# EAGLE board clock-generator (EAGLE 7.7.0)
REVISION: v2
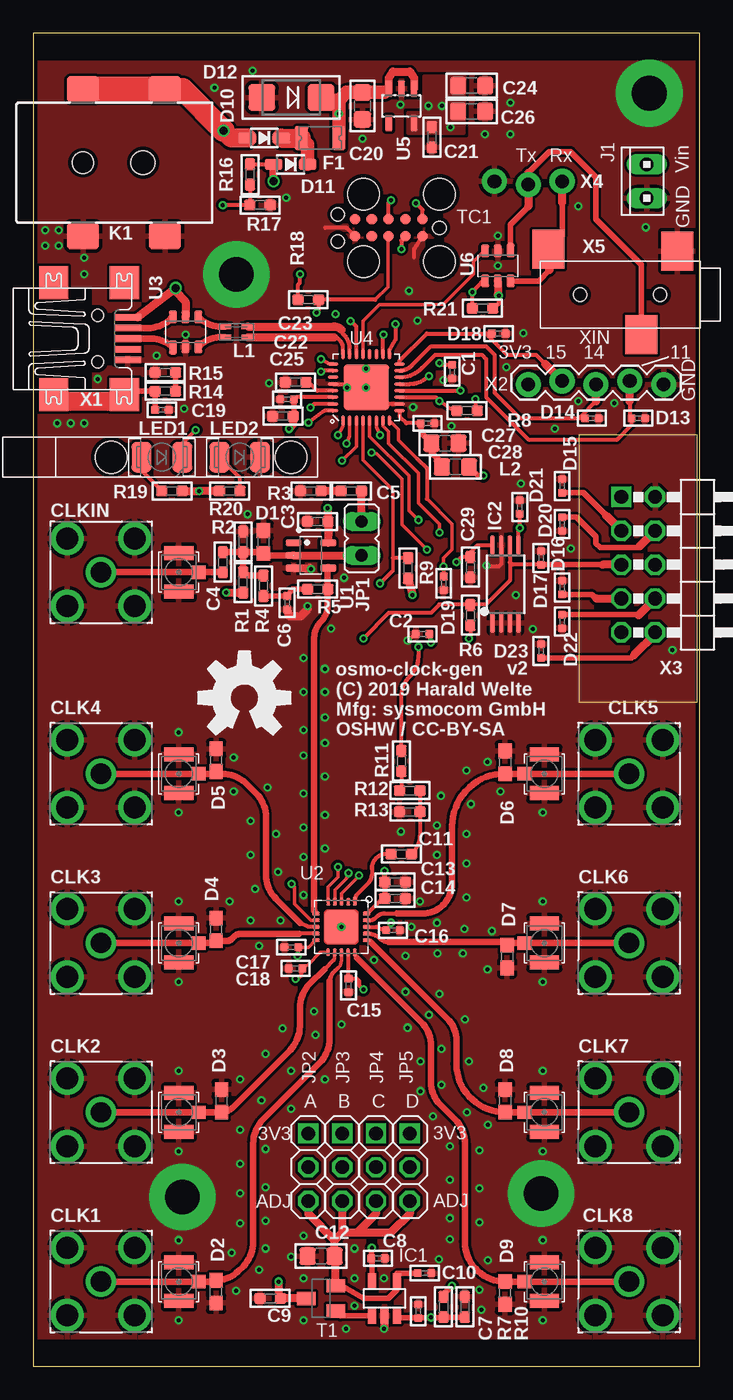
[diagram p2: board, top side]
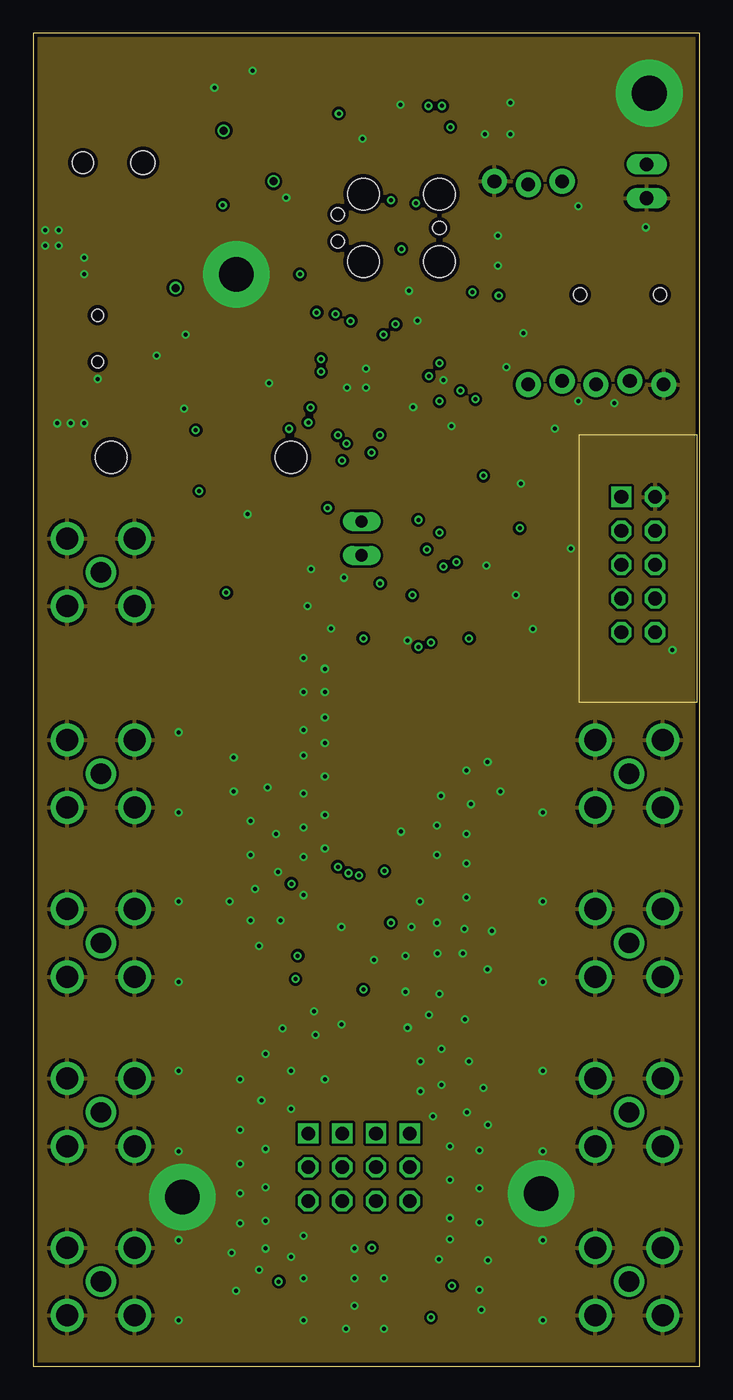
[diagram p3: board, inner layer Route2]
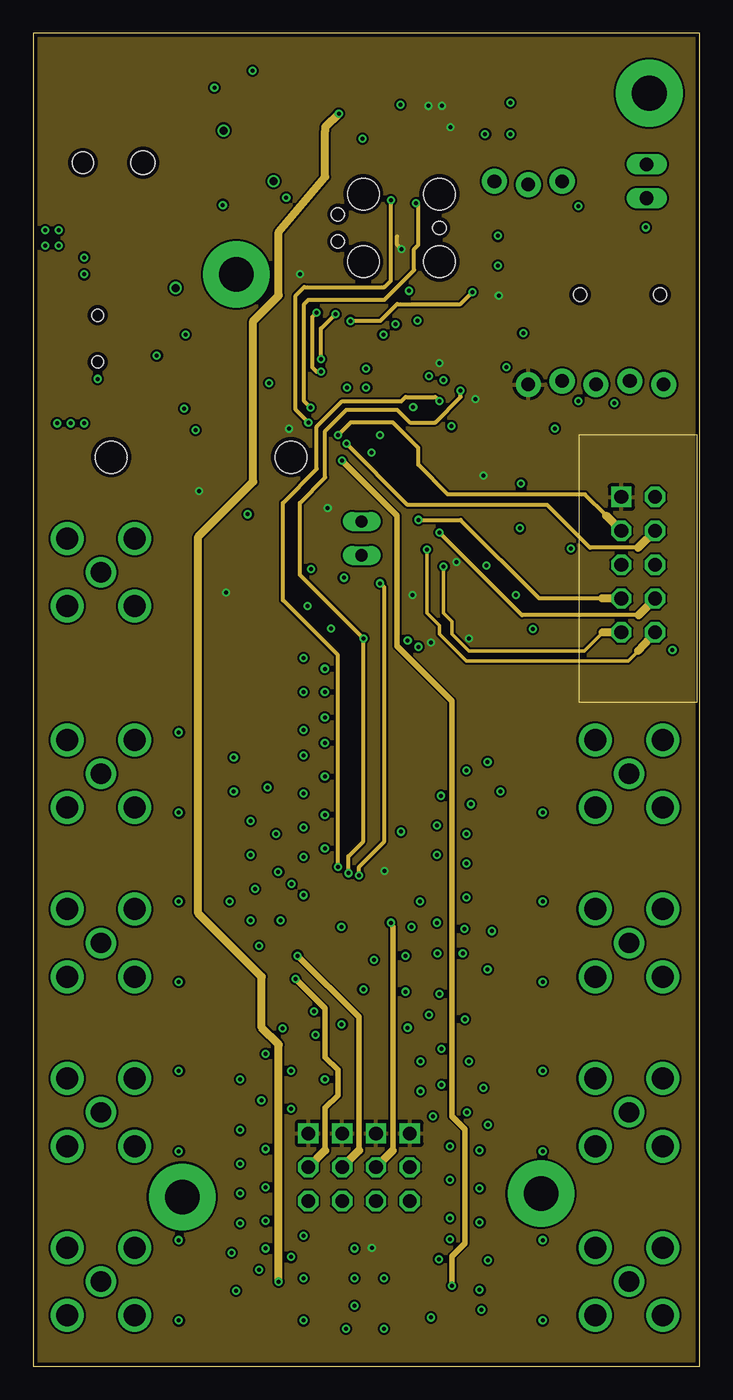
[diagram p4: board, inner layer Route15]
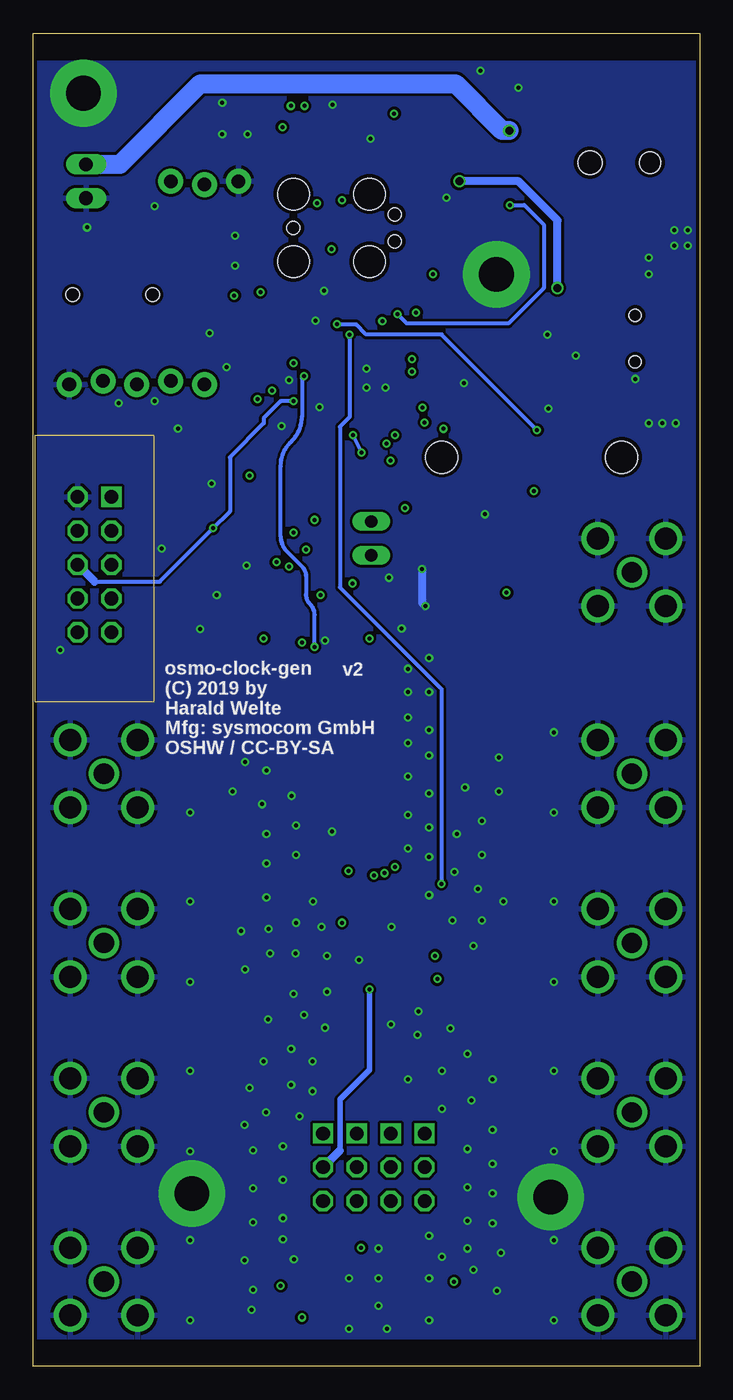
[diagram p5: board, bottom side, seen from below]

Size 50 x 100 mm. Coordinates in mm from the lower left corner, seen from the top.
Outline: 0,0 50,0 50,100 0,100 0,0
Copper layers (1*2+15*16): Top 0.018mm / dielectric 0.36mm / Route2 0.035mm / dielectric 0.71mm / Route15 0.035mm / dielectric 0.36mm / Bottom 0.018mm
Design rules "sysmocom-basista-4layer-prototype *": minimum track width 6mil, minimum drill 0.3mm, track to track 6mil, track to pad 6mil, pad to pad 6mil, via to via 6mil, smd to smd 6mil, copper to edge 0.3mm, drill to drill 0.36mm, minimum pad ring 10mil, minimum via ring 6mil, stop-mask expansion 0mil, vias tented up to drill 0mil, thermal gap 10mil
Net classes: 1 clocklines: width 1.1 mm, clearance 0.2 mm to class 0, clearance 0.2 mm; 3 usb: width 0.6 mm, drill 0.2 mm, clearance 0.2 mm to class 0, clearance 0.2 mm to class 1, clearance 0.2 mm to class 2, clearance 0.2 mm; 4 gnd-poly: width 0.4 mm, drill 0.2 mm, clearance 0.3 mm to class 0, clearance 0.18 mm to class 1, clearance 0.2 mm to class 2, clearance 0.2 mm to class 3, clearance 0.2 mm
tKeepout: area 0,0 to 50,2; area 0,98 to 50,100
bKeepout: area 0,0 to 50,2; area 0,98 to 50,100
tRestrict: area 23,71.8 to 26.8,75.2; area 21.6,31.6 to 24.6,34.3; area 0,98 to 50,100; area 0,0 to 50,2
bRestrict: area 0,98 to 50,100; area 0,0 to 50,2
Milling: area 41,49.8 to 49.8,69.8

## Footprints (pad centres in the part's own frame; a part is rotated, then mirrored left to right if it is on the bottom)
_0402 = smd 0.6 x 0.6: 1 -0.508,0; 2 0.508,0
_0603 = smd 0.9 x 0.8: 1 -0.762,0; 2 0.762,0
_0805 = smd 1.2 x 1.3: 1 -1.016,0; 2 1.016,0
HRS_UFL = smd 1.05 x 2.2: GND@1 -1.452,0; GND@2 1.452,0 | smd 1 x 1.05: SIG 0,-1.502
SMA-F-S-TH = drill 1.524: C 0,0 | drill 1.651: G1 -2.54,2.54; G2 2.54,2.54; G3 -2.54,-2.54; G4 2.54,-2.54
0603 = smd 1.1 x 1: 1 -0.85,0; 2 0.85,0
SOD-323 = smd 1.35 x 0.8: A 1.27,0; C -1.27,0
SMADIODE = smd 2 x 2: A 2.223,0; C -2.223,0
1206L = smd 1 x 1.8: 1 -1.4,0; 2 1.4,0
SOT23-5 = smd 0.6 x 1.2: 1 -0.95,-1.306; 2 0,-1.306; 3 0.95,-1.306; 4 0.95,1.306; 5 -0.95,1.306
TSSOP8 = smd 1.5 x 0.35: 1 -2.925,0.975; 2 -2.925,0.325; 3 -2.925,-0.325; 4 -2.925,-0.975; 5 2.925,-0.975; 6 2.925,-0.325; 7 2.925,0.325; 8 2.925,0.975
10X02MTA = drill 1.016 long: 1 1.27,0; 2 -1.27,0
JP1 = drill 0.914 long: 1 0,-1.27; 2 0,1.27
1X03-S = drill 1.016 square: 1 -2.54,0 | drill 1.016 octagon: 2 0,0; 3 2.54,0
694108106102 = smd 2.4 x 2: 1 11.15,5.5; 1-1 5,5.5; 2 5,-5.5; 3 11.15,-5.5 | hole 1.6: 5,0 | hole 1.8: 9.5,0
WE-CNSW_0805 = smd 0.4 x 0.9: 1 -0.4,-0.85; 2 -0.4,0.85; 3 0.4,0.85; 4 0.4,-0.85
PLCC2-MIN = smd 1.5 x 2.3: A -1.524,0; K 1.524,0
1270.1001 = hole 2.4: 13.5,0; 0,0
SOT23-BEC = smd 1 x 1.4: B -0.95,-1.1; C 0,1.1; E 0.95,-1.1
TC2050-IDC = smd 0.787 x 0.787: 1 -2.54,-0.635; 2 -2.54,0.635; 3 -1.27,-0.635; 4 -1.27,0.635; 5 0,-0.635; 6 0,0.635; 7 1.27,-0.635; 8 1.27,0.635; 9 2.54,-0.635; 10 2.54,0.635 | hole 0.991: -3.81,0; 3.81,1.016; 3.81,-1.016 | hole 2.375: -3.81,2.54; -3.81,-2.54; 1.905,2.54; 1.905,-2.54
DBV0005A = smd 0.55 x 1.2: 1 -0.95,-1.3; 2 0,-1.3; 3 0.95,-1.3; 4 0.95,1.3; 5 -0.95,1.3
QFN-20 = smd 0.65 x 0.275: 1 -1.93,1.02 | smd 0.55 x 0.275: 2 -1.88,0.52; 3 -1.88,0.02; 4 -1.88,-0.48; 5 -1.88,-0.98; 11 1.9,-0.99; 12 1.9,-0.49; 13 1.9,0.01; 14 1.9,0.51; 15 1.9,1.01 | smd 0.275 x 0.55: 6 -1,-1.9; 7 -0.5,-1.9; 8 0,-1.9; 9 0.5,-1.9; 10 1,-1.9; 16 1,1.9; 17 0.5,1.9; 18 0,1.9; 19 -0.5,1.9; 20 -1,1.9 | smd 2.5 x 2.5: EXP 0,0
TSOP-6 = smd 0.6 x 1.05: 1 -0.95,-1.175 | smd 0.6 x 0.95: 2 0,-1.125; 3 0.95,-1.125; 4 0.95,1.125; 5 0,1.125; 6 -0.95,1.125
QFN32_5X5 = smd 0.28 x 0.8: 1 -1.75,-2.5; 2 -1.25,-2.5; 3 -0.75,-2.5; 4 -0.25,-2.5; 5 0.25,-2.5; 6 0.75,-2.5; 7 1.25,-2.5; 8 1.75,-2.5; 17 1.75,2.5; 18 1.25,2.5; 19 0.75,2.5; 20 0.25,2.5; 21 -0.25,2.5; 22 -0.75,2.5; 23 -1.25,2.5; 24 -1.75,2.5 | smd 0.8 x 0.28: 9 2.5,-1.75; 10 2.5,-1.25; 11 2.5,-0.75; 12 2.5,-0.25; 13 2.5,0.25; 14 2.5,0.75; 15 2.5,1.25; 16 2.5,1.75; 25 -2.5,1.75; 26 -2.5,1.25; 27 -2.5,0.75; 28 -2.5,0.25; 29 -2.5,-0.25; 30 -2.5,-0.75; 31 -2.5,-1.25; 32 -2.5,-1.75 | smd 3.4 x 3.4: EXP 0,0
SOT23L = smd 0.55 x 1.2: 1 -0.95,-1.3; 2 0,-1.3; 3 0.95,-1.3; 4 0.95,1.3; 5 -0.95,1.3
UX60-MB-5ST = smd 2 x 0.5: 1 2.25,1.6; 2 2.25,0.8; 3 2.25,0; 4 2.25,-0.8; 5 2.25,-1.6 | smd 2.2 x 2.5: M1 -3.3,-4.2; M2 -3.3,4.2; M3 2,4.2; M4 2,-4.2 | hole 0.9: 0,-1.75; 0,1.75
1X05_LOCK = drill 1.016 pad 1.88: 1 0,0.127; 2 2.54,-0.127; 3 5.08,0.127; 4 7.62,-0.127; 5 10.16,0.127
2X05/90 = drill 1.016 square: 1 -5.08,-6.35 | drill 1.016 octagon: 2 -5.08,-3.81; 3 -2.54,-6.35; 4 -2.54,-3.81; 5 0,-6.35; 6 0,-3.81; 7 2.54,-6.35; 8 2.54,-3.81; 9 5.08,-6.35; 10 5.08,-3.81
1X03_LOCK_NO_SILK = drill 1.016 pad 1.88: 1 0,0.127; 2 2.54,-0.127; 3 5.08,0.127
JACK2.5_SJ-2523 = smd 2.4 x 2.94: 1 -4.3,-3.274; 2 5.4,-3.424; 3 -1.6,3 | hole 1: -3,0; 3,0

## Placement (x,y rotation side)
C1  10n  [_0402]  31.43,74.61 90 top
C2  10n  [_0402]  29.21,54.93 0 top
C3  100n  [_0603]  21.34,63.37 0 top
C4  100n  [_0603]  14.22,60.33 90 top
C5  100n  [_0603]  23.88,65.66 0 top
C6  10n  [_0402]  19.05,57.28 270 top
C7  10n  [_0402]  28.89,4.13 270 top
C8  100n  [_0402]  25.88,8.1 180 top
C9  1u  [_0603]  17.78,5.08 180 top
C10  100n  [_0402]  29.37,6.99 180 top
C11  100n  [_0603]  27.62,38.42 180 top
C12  22u  [_0805]  21.59,8.26 0 top
C13  1u  [_0603]  27.15,36.32 180 top
C14  100n  [_0603]  27.15,35.08 0 top
C15  100n  [_0402]  23.65,28.57 270 top
C16  100n  [_0402]  26.99,32.7 0 top
C17  100n  [_0402]  19.37,31.43 180 top
C18  100n  [_0402]  19.68,29.84 180 top
C19  10n  [_0402]  9.65,71.75 0 top
C20  4.7u  [_0805]  24.7,94.55 90 top
C21  100n  [_0603]  29.91,92.2 270 top
C22  100n  [_0402]  19.05,72.55 0 top
C23  1u  [_0603]  19.68,73.82 0 top
C24  4.7u  [_0805]  32.9,96.08 180 top
C25  1u  [_0603]  18.73,71.28 0 top
C26  4.7u  [_0805]  32.9,94.14 180 top
C27  100n  [_0402]  29.59,70.74 180 top
C28  4.7u  [_0805]  30.89,69.25 180 top
C29  100n  [_0603]  32.8,59.95 90 top
CLK0U  [HRS_UFL]  10.92,6.35 90 top
CLK1  [SMA-F-S-TH]  5.08,6.35 0 top
CLK1U  [HRS_UFL]  10.92,19.05 90 top
CLK2  [SMA-F-S-TH]  5.08,19.05 0 top
CLK2U  [HRS_UFL]  10.92,31.75 90 top
CLK3  [SMA-F-S-TH]  5.08,31.75 0 top
CLK3U  [HRS_UFL]  10.92,44.45 90 top
CLK4  [SMA-F-S-TH]  5.08,44.45 0 top
CLK4U  [HRS_UFL]  38.35,44.45 270 top
CLK5  [SMA-F-S-TH]  44.7,44.45 0 top
CLK5U  [HRS_UFL]  38.35,31.75 270 top
CLK6  [SMA-F-S-TH]  44.7,31.75 0 top
CLK6U  [HRS_UFL]  38.35,19.05 270 top
CLK7  [SMA-F-S-TH]  44.7,19.05 0 top
CLK7U  [HRS_UFL]  38.35,6.35 270 top
CLK8  [SMA-F-S-TH]  44.7,6.35 0 top
CLKIN  [SMA-F-S-TH]  5.08,59.56 0 top
CLKINU  [HRS_UFL]  10.92,59.56 90 top
D1  [0603]  17.27,61.85 270 top
D2  [0603]  13.72,5.59 90 top
D3  [0603]  14.13,19.91 270 top
D4  [0603]  13.72,32.77 270 top
D5  [0603]  13.72,45.47 270 top
D6  [0603]  35.4,45.31 270 top
D7  [0603]  35.56,30.73 90 top
D8  [0603]  35.4,19.91 270 top
D9  [0603]  35.4,5.49 90 top
D10  CUS08F30  [SOD-323]  17.34,92.14 180 top
D11  CUS08F30  [SOD-323]  19.3,90.17 180 top
D12  5.6V  [SMADIODE]  19.37,95.19 180 top
D13  GG040205170N2P  [_0402]  45.4,71.12 180 top
D14  GG040205170N2P  [_0402]  41.91,71.12 180 top
D15  GG040205170N2P  [_0402]  39.69,66.04 90 top
D16  GG040205170N2P  [_0402]  38.1,60.64 90 top
D17  GG040205170N2P  [_0402]  39.69,58.42 90 top
D18  GG040205170N2P  [_0402]  34.92,77.47 180 top
D19  GG040205170N2P  [_0402]  30.8,58.74 90 top
D20  GG040205170N2P  [_0402]  39.69,63.18 90 top
D21  GG040205170N2P  [_0402]  36.51,64.45 270 top
D22  GG040205170N2P  [_0402]  39.69,55.88 90 top
D23  GG040205170N2P  [_0402]  38.1,53.66 270 top
F1  200mA  [1206L]  21.53,92.14 180 top
IC1  TLV9001IDBVR  [SOT23-5]  26.35,5.08 0 top
IC2  AT24C02C  [TSSOP8]  35.44,58.67 90 top
J1  [10X02MTA]  46.04,88.9 90 top
JP1  [JP1]  24.64,62.1 0 top
JP2  [1X03-S]  20.64,14.92 270 top
JP3  [1X03-S]  23.18,14.92 270 top
JP4  [1X03-S]  25.72,14.92 270 top
JP5  [1X03-S]  28.26,14.92 270 top
K1  694108106102  [694108106102]  -1.27,90.3 0 top
L1  744231091  [WE-CNSW_0805]  15.24,77.6 90 top
L2  [_0805]  31.69,67.47 0 top
LED1  yellow  [PLCC2-MIN]  9.65,68.2 0 top
LED2  green  [PLCC2-MIN]  15.49,68.2 0 top
M1  MENTOR_12701001  [1270.1001]  5.84,68.2 0 top
R1  10k  [_0603]  15.75,58.8 270 top
R2  10k  [_0603]  15.75,61.85 270 top
R3  49.9  [_0603]  20.83,65.66 0 top
R4  510k  [_0603]  17.27,58.55 90 top
R5  510k  [_0603]  21.34,58.29 0 top
R6  4,7k  [_0603]  32.8,56.35 90 top
R7  0  [_0603]  30.8,4.45 90 top
R8  4,7k  [_0603]  32.55,71.69 180 top
R9  10k  [_0603]  28.13,59.88 90 top
R10  100k  [_0603]  32.38,4.45 270 top
R11  0  [_0603]  27.62,45.4 90 top
R12  47k  [_0603]  28.26,43.18 0 top
R13  30k  [_0603]  28.26,41.59 180 top
R14  100k  [_0603]  9.91,73.15 180 top
R15  100k  [_0603]  9.91,74.55 0 top
R16  30k  [_0603]  16.26,89.41 90 top
R17  47k  [_0603]  17.02,87.12 180 top
R18  100k  [_0603]  20.64,80.01 0 top
R19  330  [_0603]  10.41,65.66 0 top
R20  330  [_0603]  14.73,65.66 180 top
R21  100k  [_0603]  33.72,79.38 0 top
T1  BC847  [SOT23-BEC]  21.59,5.08 90 top
TC1  TC2050-IDC  [TC2050-IDC]  26.67,85.41 180 top
U1  SN74LVC1G04DBV  [DBV0005A]  20.83,60.83 270 top
U2  SI5351C  [QFN-20]  23.11,32.96 270 top
U3  IP4234CZ6  [TSOP-6]  11.43,77.6 0 top
U4  ATSAMD21E  [QFN32_5X5]  24.99,73.44 0 top
U5  ADP151AUJZ  [SOT23L]  27.63,94.55 180 top
U6  IP4234CZ6  [TSOP-6]  34.86,82.55 180 top
U$1  [OSHW-LOGO-L]  15.84,50.14 0 top
X1  MINI-USB-SHIELD-UX60-MB-5ST  [UX60-MB-5ST]  4.83,77.09 0 top
X2  [1X05_LOCK]  47.31,73.79 180 top
X3  UEXT/90  [2X05/90]  50.48,60.13 270 top
X4  [1X03_LOCK_NO_SILK]  34.61,88.77 0 top
X5  JACK2.5_SJ-2523  [JACK2.5_SJ-2523]  44.04,80.39 180 top

## Tracks (layer width: path | path; a pad name or v marks a point on that pad's centre or on a via)
!INT  (via drill 0.3)
  Top 0.254: U2.3 23.13,35.48 24.45,36.79 v24.45,36.83 | U4.4 24.74,67.97 26.99,65.72 26.99,60.64 26.99,59.69
  Top 0.305: v26.04,58.74 26.99,59.69 | R9.2 26.99,60.64
  Route15 0.305: v24.45,36.83 24.45,37.47 26.35,39.37 26.35,58.42 v26.04,58.74
!LED_YELLOW  (via drill 0.3)
  Top 0.305: LED1.K 11.18,69.22 v12.19,70.23 | U4.17 26.74,76.27 27.2,77.04 v27.2,78.17
  Bottom 0.305: v12.19,70.23 19.37,77.41 25.02,77.41 25.78,78.17 v27.2,78.17
!OEB  (via drill 0.3)
  Top 0.254: U2.7 20.84,33.46 19.62,34.67 19.62,35.94 v19.37,36.2
  Top 0.305: U4.18 26.24,77.37 v26.27,77.39
  Bottom 0.305: v26.27,77.39 26.27,71.21 26.99,70.48 26.99,58.42 19.37,50.8 v19.37,36.2
!RESET  (via drill 0.3)
  Top 0.254: 25.65,80.01 26.61,80.96 26.61,84.71 TC1.6
  Top 0.305: U4.26 21.67,74.69 v21.59,74.61 | v21.27,79.06 21.4,79.18 R18.2 25.65,80.01
  Route15 0.305: v21.59,74.61 21.27,74.61 20.95,74.93 20.95,78.74 v21.27,79.06
!SPI_SS  (via drill 0.3)
  Top 0.254: U4.6 25.74,70.46 v26.01,69.87 | v25.37,68.53 25.75,68.47 27.67,66.56 27.67,63.14 v29.53,61.28
  Top 0.406: D23.2 44.9,53.15 45.09,53.34
  Top 0.61: X3.10 46.67,54.93 45.09,53.34
  Route15 0.254: 45.4,53.66 44.64,52.9 32.51,52.9 30.48,54.93 30.48,55.56 29.53,56.52 v29.53,61.28
  Route15 0.6: 45.4,53.66 X3.10
  Bottom 0.254: v26.01,69.87 v25.37,68.53
CLK0_LINE
  Top 0.254: U2.13 23.12,30.48 arc-45 22.86,29.84
  Top 0.305: 22.86,29.84 arc45 22.23,28.95 22.23,28.89
  Top 0.5: CLK1.C CLK0U.SIG 13.63,6.35 | 22.23,28.89 22.23,24.55 arc-45 21.48,22.75 17.25,18.52 arc45 16.51,16.73 16.51,9.31 arc-45 15.77,7.51 15.38,7.13 arc-45 D2.2
  Top 0.65: 13.63,6.35 arc90 D2.2
CLK1_LINE
  Top 0.254: U2.12 22.62,30.68 arc-45 22.54,30.48
  Top 0.305: 22.54,30.48 arc-45 22.54,30.48 21.84,29.78
  Top 0.5: CLK2.C CLK1U.SIG D3.2 | D3.2 arc45 14.95,19.4 19.26,23.7 arc45 20,25.5 20,26.89 arc-45 20.75,28.68 21.84,29.78
  Top 0.6: D3.2
CLK2_LINE
  Top 0.3: U2.9 19.57,32.46 19.94,32.45
  Top 0.305: 13.55,31.75 D4.2
  Top 0.5: CLK3.C CLK2U.SIG 13.55,31.75 | 19.94,32.45 15.53,32.45 arc45 14.92,32.07 arc-45 14.56,31.92 D4.2
CLK3_LINE
  Top 0.305: 13.8,44.62 13.97,44.45 | U2.8 20.64,32.96 20,33.27
  Top 0.5: CLK4.C CLK3U.SIG 13.97,44.45 14.19,44.45 arc-45 15.98,43.71 16.72,42.97 arc-45 17.46,41.17 17.46,36.87 arc45 18.21,35.07 20,33.27
  Top 0.65: D5.2 13.8,44.62
CLK4_LINE
  Top 0.305: U2.19 25.24,33.46 arc45 25.72,33.66 25.81,33.75 arc-45 26.35,33.97 27.3,33.97
  Top 0.5: CLK5.C CLK4U.SIG 35.56,44.45 D6.2 arc90 31.43,40.49 31.43,36.2 arc-90 29.21,33.97 27.3,33.97
CLK5_LINE
  Top 0.254: 26.67,31.81 26.65,31.81
  Top 0.305: 26.65,31.81 arc-45 26.04,32.07 arc45 25.1,32.46 U2.17
  Top 0.5: CLK6.C CLK5U.SIG 35.73,31.75 D7.2 35.33,31.81 26.67,31.81
  Top 0.65: 35.56,31.75 D7.2
CLK6_LINE
  Top 0.254: U2.16 arc-45 25.32,31.83
  Top 0.406: D8.2 35.31,19.06 arc90 35.31,19.05
  Top 0.5: CLK7.C CLK6U.SIG 35.31,19.05 | D8.2 arc-90 31.75,22.69 31.75,24.45 arc45 31.08,26.07 25.32,31.83
CLK7_LINE
  Top 0.254: U2.15 arc45 24.3,30.62
  Top 0.5: CLK8.C CLK7U.SIG 35.73,6.35 arc-90 35.72,6.34 D9.2 arc-90 32.38,9.36 32.38,16.73 arc45 31.64,18.52 30.52,19.65 arc-45 29.84,21.27 29.84,24.03 arc45 29.1,25.83 24.3,30.62
CLKIN
  Top 0.5: CLKIN.C CLKINU.SIG C4.1
CLKIN_AC
  Top 0.5: C4.2 R2.2 | R2.2 R1.1 16,59.31 R4.2 | R2.2 17.18,61.09 D1.2 17.44,60.83 U1.2
  Top 0.61: U1.2 JP1.1
CLKIN_CMOS
  Top 0.305: U2.6 21.21,34.16 arc45 21.08,34.16
  Top 0.5: 22.1,59.85 R5.2 22.1,57.11 arc-45 21.59,55.88 arc45 21.08,54.65 21.08,34.16
  Top 0.61: 22.1,59.85 U1.4
DAC_VIO  (via drill 0.3)
  Top 0.254: U4.3 24.24,69.01 v23.18,67.94
  Top 0.406: R7.2 30.8,5.4 v31.43,6.03
  Route15 0.406: v31.43,6.03 31.43,8.26 32.38,9.21 32.38,17.78 31.43,18.73 31.43,49.92 27.31,54.04 27.31,63.81 v23.18,67.94
GND  (via drill 0.3, 2.6 pad 5)
  Top 0.254: TC1.2 28.57,83.82 28.57,83.19
  Top 0.305: IC2.7 35.11,60.2 34.92,60.01 34.07,60.01 v34,60.07 | U4.28 24.74,73.69 U4.EXP v24.98,73.42 26.21,72.19 U4.10 | C2.1 28.07,54.42 v28.1,54.45 | C1.1 30.83,73.95 v30.8,73.98 | TC1.10 23.5,85.41 21.91,85.41
  Top 0.61: U1.3 20.76,59.88 v20.83,59.82 | v20.57,57.02 20.57,56.77 20.07,56.26 19.22,56.26 C6.2 | IC1.2 26.35,2.98 v26.32,2.79
  Bottom 0.61: v20.83,59.82 20.83,57.28 v20.57,57.02
  other vias: 11.18,12.7 38.1,12.95 15.24,81.92 46.23,95.5 0.89,85.22 1.9,85.22 3.81,81.92 0.89,84.07 1.9,84.07 3.81,83.19 1.78,70.74 2.79,70.74 3.81,70.74 4.83,74.07 24.1,6.6 26.32,6.6 30.45,8.03 20.29,9.78 19.34,8.19 24.1,8.83 20.29,6.6 20.29,3.43 23.46,2.79 24.1,4.54 33.62,4.22 28.51,71.95 31.37,70.52 37.5,55.31 40.89,87.03 23.55,73.42 35.5,74.96 28.83,78.45 23.11,32.96 24.98,74.85 15.21,5.65 14.89,8.51 15.53,10.73 15.53,12.95 15.53,15.18 15.53,17.72 17.11,19.94 19.34,22.16 15.53,21.53 17.43,23.43 18.7,25.34 21.08,26.61 21.17,24.86 23.15,25.65 19.34,19.3 17.43,16.29 17.43,8.83 17.43,13.43 17.43,10.89 16.95,7.24 38.23,9.46 38.23,3.43 10.92,3.43 10.92,9.46 10.92,22.16 10.92,16.13 38.23,22.16 38.23,16.13 38.23,28.83 38.23,34.86 34.1,29.78 33.78,20.89 10.92,28.83 10.92,34.86 14.73,34.86 38.23,41.53 34.1,45.34 32.83,42.16 32.51,39.94 32.51,37.72 32.51,35.18 30.29,33.27 30.29,38.35 30.29,40.58 32.51,44.7 35.05,43.12 10.92,41.53 10.92,47.56 15.05,45.66 15.05,43.12 17.59,43.43 20.29,35.34 20.29,38.2 20.29,40.42 20.29,42.96 20.29,45.82 21.88,38.83 21.88,41.37 21.88,44.23 21.88,46.77 30.61,42.8 21.88,48.67 21.88,50.58 20.29,47.72 20.29,50.58 20.29,53.12 22.35,55.34 23.3,59.15 28.38,32.96 29.02,34.86 32.35,32.8 34.42,32.64 32.23,30.96 30.32,30.96 27.94,30.8 30.48,27.94 25.56,30.48 27.94,28.1 29.69,26.35 30.64,23.81 30.64,21.11 32.54,19.05 34.13,18.1 33.5,16.19 33.5,13.34 33.5,10.79 34.13,7.94 21.88,52.32 32.38,26.04 32.7,22.86 28.1,25.4 29.05,22.86 29.05,20.64 30,18.73 16.32,40.89 16.32,38.35 16.64,35.81 18.54,33.43 16.32,33.43 16.95,31.53 31.27,16.51 31.27,13.97 31.27,11.11 31.27,9.53 33.5,5.71 21.88,21.53 27.59,40.1 18.22,39.94 18.38,37.08 35.81,92.42 33.91,92.42 35.81,94.81 27.56,94.65 24.7,92.11 18.99,87.66 11.33,71.85 17.68,73.76 16.1,63.91 34.86,84.8 9.27,75.82 11.43,77.4 34.86,82.58 45.97,85.44 28.19,80.68 16.45,97.19 40.89,72.42 39.15,70.36 43.59,72.26 36.77,77.5 40.35,61.34 36.23,57.85 47.97,53.72 36.61,66.23 13.59,95.92
  pour Top (rank 2): 0,99.59 50.04,99.59 50.36,0.41 0.32,0.41
  pour Route2: 0.32,99.69 49.85,99.69 49.53,0.32 0,0.32
  pour Bottom (rank 6): 0,99.59 50.04,99.59 50.04,0.41 0,0.41
I2C_SCL  (via drill 0.3)
  Top 0.254: U2.4 22.63,35.72 23.5,36.58 v23.65,36.99
  Top 0.305: 32.84,57.15 33.97,57.15 35.76,58.94 35.76,60.33 | 32.84,57.15 R6.2 | IC2.6 35.76,60.33 | U4.12 v32.07,73.19 | D16.1 35.95,60.13 35.76,60.33 | 32.84,57.15 30.48,57.15 29.84,56.52 26.67,56.52 v24.77,54.61
  Top 0.406: 42.74,60.13 38.42,60.13 D16.1
  Top 0.61: X3.5 42.74,60.13
  Route15 0.305: v23.65,36.99 23.65,38.26 24.77,39.37 v24.77,54.61 20,59.37 20,64.77 21.91,66.67 21.91,70.17 23.5,71.75 27.3,71.75 28.26,70.8 30.16,70.8 32.07,72.71 v32.07,73.19
I2C_SDA  (via drill 0.3)
  Top 0.254: U2.5 22.13,35.97 22.86,36.69 v22.86,37.47 | 30.48,72.42 v30.48,72.39
  Top 0.305: U4.11 30.2,72.69 30.48,72.42 | R8.2 31.5,71.69 v30.48,72.39 | IC2.5 36.41,62.77 v36.51,62.87 D21.2
  Route15 0.305: v22.86,37.47 22.86,53.34 18.73,57.47 18.73,64.77 21.27,67.31 21.27,70.48 23.18,72.39 27.62,72.39 27.94,72.71 30.16,72.71 v30.48,72.39
  Bottom 0.305: v30.48,72.39 31.43,72.39 32.7,71.12 32.7,70.74 35.24,68.2 35.24,64.14 v36.51,62.87 40.51,58.86 45.4,58.86
  Bottom 0.6: X3.6 45.4,58.86
N$1
  Top 0.305: U4.29 21.3,73.19 20.67,73.82 C23.2
N$2
  Top 0.305: R11.1 27.62,43.49 arc-45 R12.1
N$3
  Top 0.61: C5.1 R3.2
N$4
  Top 0.305: R12.2 R13.1 29.02,39.95 arc-45 C11.1
N$5
  Top 0.406: R4.1 C6.1 19.47,58.29 R5.1
N$6
  Top 1.016: F1.2 20.57,91.69 D11.C
  Top 1.422: D10.C F1.2
N$7
  Top 0.61: JP1.2 C5.2
N$8
  Top 0.305: U2.1 arc-45 24.39,35.5 25.18,36.29 arc45 25.4,36.83 25.4,37.33 arc-45 25.72,38.1 arc-45 26.48,38.42 C11.2
N$11
  Top 0.305: LED2.A 15.49,66.67 R20.1
N$12
  Top 0.305: LED1.A 8.13,67.18 R19.1
N$13
  Top 0.305: C27.2 28,70.74 27.49,71.25 U4.9
  Top 0.406: C27.2 29.08,70.04 C28.2 29.88,68.55 30.67,67.75 L2.1
N$15  (via drill 0.6)
  Top 1.422: K1.1 10.19,95.8 | D10.A 14.86,92.14 v14.29,92.71
  Top 1.676: 10.19,95.8 11.2,95.8 v14.29,92.71
  Top 1.93: K1.1-1 K1.1
  Bottom 1.422: J1.1 43.5,90.17 37.47,96.2 18.29,96.2 14.8,92.71 v14.29,92.71
N$21  (via drill 0.3)
  Top 0.254: v29.84,3.65 29.84,3.62
  Top 0.406: IC1.3 27.3,3.62 C7.2 29.84,3.62 30.73,3.62 R7.1 R10.2
N$23
  Top 0.406: IC1.1 23.05,3.77 T1.B
N$55
  Top 0.406: R14.1 R15.2
N$61
  Top 0.406: X1.M4 6.96,73.15 R14.2 C19.1
  Top 1.422: X1.M1 2.02,72.39 6.35,72.39 6.83,72.87 X1.M4
PA11
  Top 0.305: U4.14 arc45 29.17,74.89 30.16,75.88 33.66,75.88 33.97,75.56 33.97,72.71 37.15,69.53 43.81,69.53 44.9,70.61 D13.2 44.79,71.22 44.77,71.22 44.77,72.39
  Top 0.6: 44.77,72.39 X2.2
PA14
  Top 0.305: U4.15 arc45 28.39,75.07 29.84,76.52 33.97,76.52 34.61,75.88 34.61,73.03 36.51,71.12 40.96,71.12 41.12,71.28 | 41.12,71.28 42.23,72.39 | D14.2 41.12,71.12 41.12,71.28
  Top 0.6: 42.23,72.39 X2.3
PA15
  Top 0.305: U4.16 27.49,75.43 29.53,77.47 33.97,77.47 34.13,77.31 | 34.13,77.31 35.56,75.88 37.72,75.88 38.42,75.18 | 34.13,77.31 34.29,77.47 D18.2
  Top 0.61: X2.4 38.42,75.18
SPI_MISO  (via drill 0.3)
  Top 0.254: U4.5 25.24,69.75 28.19,66.81 28.19,64.2 v28.89,63.5
  Top 0.406: D17.1 41.91,57.91 42.23,57.59
  Top 0.61: 42.23,57.59 X3.7
  Route15 0.305: v28.89,63.5 32.07,63.5 37.97,57.59 42.67,57.59
  Route15 0.6: X3.7 42.67,57.59
SPI_MOSI  (via drill 0.3)
  Top 0.254: U4.7 26.24,70.53 26.65,70.13 26.65,69.24 28.89,66.99 28.89,64.77 30.48,63.18 v30.48,62.55
  Top 0.305: 45.4,56.39 45.43,56.36
  Top 0.406: D22.2 45.4,56.39
  Top 0.61: 45.43,56.36 X3.8
  Route15 0.305: 45.43,56.36 36.67,56.36 v30.48,62.55
  Route15 0.6: X3.8 45.43,56.36
SPI_SCK  (via drill 0.3)
  Top 0.254: 28.83,68.07 27.43,69.48 27.43,70.26 U4.8 | 29.53,65.09 31.43,63.18 31.43,61.28 30.8,60.64 v30.8,60.01
  Top 0.305: 28.83,68.07 29.53,67.37 29.53,65.09 | v30.8,60.01 D19.2
  Route15 0.254: v30.8,60.01 30.8,56.52 31.43,55.88 31.43,54.93 32.7,53.66 41.34,53.66 42.74,55.05
  Route15 0.6: X3.9 42.74,55.05
SWCLK  (via drill 0.3)
  Top 0.305: U4.31 21.07,72.19 v20.8,71.91 | TC1.1 29.21,86.76 v28.72,87.25
  Route15 0.305: v28.72,87.25 28.89,87.08 28.89,84.14 28.57,83.82 28.57,82.23 26.35,80.01 20.64,80.01 20.32,79.69 20.32,72.39 v20.8,71.91
SWDIO  (via drill 0.3)
  Top 0.305: U4.32 21.84,71.69 v20.64,70.8 | TC1.5 26.67,87.31 v26.83,87.47
  Route15 0.305: v20.64,70.8 19.68,71.75 19.68,80.33 20.32,80.96 26.35,80.96 26.83,81.44 v26.83,87.47
UART_RX  (via drill 0.3)
  Top 0.305: U4.22 24.24,78 v23.81,78.42 | U6.4 33.8,81.53 v32.96,80.58 R21.1
  Route15 0.305: v23.81,78.42 26.04,78.42 27.3,79.69 32.07,79.69 v32.96,80.58
UART_RX0
  Top 0.406: X5.2 39.69,84.86 39.69,87.31 | 38.73,82.23 37.93,81.42 U6.6
  Top 0.61: 38.73,82.23 38.73,83.72 X5.2 | 39.69,87.31 X4.3
UART_RX1  (via drill 0.3)
  Top 0.254: U4.2 23.74,69.78 v23.5,69.22
  Top 0.406: D20.2 40.77,63.69 42.23,62.23 42.23,61.72 42.55,61.4 45.4,61.4 45.5,61.5
  Top 0.61: 45.5,61.5 X3.4
  Route15 0.305: v23.5,69.22 28.1,64.61 38.58,64.61 41.78,61.4 45.4,61.4
  Route15 0.61: X3.4 45.4,61.4
UART_TX
  Top 0.254: U4.21 24.74,78.4 25.97,79.63 29.78,79.63 30.8,79.69 33.02,81.92 33.02,82.87 33.97,83.82
  Top 0.305: 33.97,83.82 33.77,83.82 U6.3
UART_TX0
  Top 0.406: U6.1 35.81,85.66 37.15,87 | X5.3 45.64,82.63 42.23,86.04 42.23,89.22 40.32,91.12 38.73,91.12 37.15,89.53
  Top 0.61: 37.15,87 X4.2 37.15,89.53
UART_TX1  (via drill 0.3)
  Top 0.254: U4.1 23.24,70.55 v22.86,69.85
  Top 0.406: D15.1 41.27,65.53 42.99,63.82
  Top 0.61: 42.99,63.82 X3.3
  Route15 0.305: v22.86,69.85 23.81,70.8 26.99,70.8 28.89,68.9 28.89,67.63 31.11,65.41 41.4,65.41 42.99,63.82
  Route15 0.61: X3.3 42.99,63.82
USB0_D_N
  Top 0.5: X1.2 8.6,77.89 arc45 10.39,78.63
  Top 0.6: 10.39,78.63 U3.6
USB0_D_P
  Top 0.5: X1.3 8.87,77.09 arc-45 U3.1
USB1_D_N
  Top 0.5: U3.4 arc45 14.13,78 L1.3
USB1_D_P
  Top 0.5: U3.3 arc-45 14.13,77.2 L1.2
USB_D_N
  Top 0.305: U4.23 23.74,76.4 arc45 23.36,77.33 23.29,77.4 arc-45 23.14,77.75
  Top 0.6: L1.4 22.55,78 arc-45 23.14,77.75
USB_D_P
  Top 0.254: 22.58,77.19 arc-45 22.56,77.19
  Top 0.305: U4.24 23.24,76.39 arc45 23,76.97 22.93,77.04 arc45 22.56,77.19
  Top 0.6: L1.1 22.55,77.2 arc-45 22.58,77.19
V_IN  (via drill 0.3)
  Top 0.61: U5.1 28.58,96.65 28.26,97.12 26.99,97.12 26.68,96.65 U5.3 26.68,95.63 26.36,95.57 | T1.C C9.1 18.41,5.21 v18.41,6.35
  Top 1.016: 26.36,95.57 C20.2 23.5,95.57 22.93,95 | F1.1 v22.93,93.98 22.93,95 | 22.93,95 21.78,95 D12.C
  Route15 0.6: v18.41,6.35 18.41,24.13 17.14,25.4 17.14,29.21 12.38,33.97 12.38,62.23 16.51,66.36 16.51,78.42 18.41,80.33 18.41,85.09 21.91,89.22 21.91,92.71
  Route15 0.61: v22.93,93.98 21.91,92.96 21.91,92.71
VBUS  (via drill 0.6)
  Top 0.305: R16.2 D11.A
  Top 0.5: X1.1 7.82,78.69
  Top 0.6: 11.43,79.88 U3.5
  Top 0.61: 11.43,79.88 10.67,80.64 v10.67,80.9 | v18.03,88.9 D11.A
  Top 0.65: 7.82,78.69 v10.67,80.9
  Bottom 0.61: v10.67,80.9 10.67,85.98 13.59,88.9 v18.03,88.9
VBUS_DET  (via drill 0.3)
  Top 0.305: R16.1 R17.2 v14.22,87.12 | U4.25 22.28,75.19 v21.59,75.56
  Route15 0.305: v21.59,75.56 21.59,77.85 v22.67,78.93
  Bottom 0.305: v14.22,87.12 13.14,87.12 11.68,85.66 11.68,80.9 14.35,78.23 21.97,78.23 v22.67,78.93
VDD  (via drill 0.3)
  Top 0.254: U2.20 25.13,33.96
  Top 0.305: 25.13,33.96 25.13,34.02 26.19,35.08 C14.1 | U4.30 19.7,72.69 C22.2 | IC2.8 33.34,61.59 32.83,61.09 C29.2 32.13,60.71 v31.75,60.33 | R6.1 32.8,54.71 v32.7,54.61 | v33.18,72.55 33.18,71.72 R8.1 | R18.1 19.88,81.15 20,81.28 v20,81.92 | R21.2 34.92,79.69 v34.92,80.33 | C2.2 29.72,54.74 v29.84,54.29 | C1.2 30.61,75.12 v30.48,75.25 | TC1.4 27.62,84.45 v27.62,83.82
  Top 0.406: IC1.5 25.4,8.06 C8.2 25.37,8.86 v25.4,8.89 | C14.1 C13.2 26.35,36.2 v26.35,37.15 | C22.2 19.56,71.34 C25.2 | v33.78,66.81 33.36,66.81 L2.2
  Top 0.6: C25.2 19.49,70.67 v19.21,70.33 | U6.5 34.86,80.39 v34.92,80.33
  Top 0.61: R19.2 v12.45,65.66 R20.2 | v14.48,58.04 R1.2 | C3.2 22.13,63.34 U1.5 22.16,62.8 v22.1,64.39 | R9.1 v28.45,57.85
  Route15 0.305: v27.62,83.82 27.3,84.14 27.3,84.77
  other vias: 29.66,94.55 30.67,94.55 31.31,92.96
  pour Top (no thermals): 28.14,94.04 29.31,94.04 29.31,96.77 32.38,96.77 32.33,92.52 28.14,92.52
  pour Route15: 0,99.69 49.53,99.69 49.53,0.32 0,0.32
VDDIO_ADJ
  Top 0.406: T1.E 23.18,6.03 24.77,5.08 26.67,5.08 27.3,5.71 IC1.4 27.3,6.96 C10.2
  Top 0.6: T1.E 22.69,8.17 C12.2 22.61,9.46 | JP2.3 20.64,11.43 22.61,9.46 | JP4.3 25.72,11.43 24.32,10.03 | JP3.3 23.18,10.03 | 23.18,10.03 22.61,9.46 | 23.18,10.03 24.32,10.03 | JP5.3 28.26,11.43 26.86,10.03 24.32,10.03
VDDOA  (via drill 0.3)
  Top 0.254: U2.11 21.53,31.06 20.64,30.16 C18.1
  Top 0.305: C18.1 20.19,29.72 20,29.21 19.84,29.05 v19.68,29.05
  Route15 0.406: v19.68,29.05 21.91,26.83 21.91,23.18 22.86,22.23 22.86,20.32 21.91,19.37 21.91,16.19
  Route15 0.6: JP2.2 21.91,16.19
VDDOB  (via drill 0.3)
  Top 0.254: U2.10 21.16,31.96 20.64,31.43 C17.1
  Top 0.305: C17.1 19.88,30.83 v19.84,30.8
  Route15 0.406: v19.84,30.8 24.45,26.19 24.45,16.19
  Route15 0.6: JP3.2 24.45,16.19
VDDOC  (via drill 0.3)
  Top 0.305: v26.83,33.27 26.67,32.89 C16.1 26.35,32.7 25.78,32.96 U2.18
  Route15 0.406: 26.99,16.19 26.99,32.96 v26.83,33.27
  Route15 0.6: JP4.2 26.99,16.19
VDDOD  (via drill 0.3)
  Top 0.254: 23.62,29.11 C15.1
  Top 0.305: U2.14 23.62,29.11 | C15.1 24.26,29.08 24.45,28.89 24.45,28.57 v24.77,28.26
  Bottom 0.406: v24.77,28.26 24.77,22.23 26.99,20 26.99,16.19
  Bottom 0.6: JP5.2 26.99,16.19
XA  (via drill 0.3)
  Top 0.305: R11.2 27.62,50.22 arc-45 28.26,51.75 arc45 28.89,53.29 v28.89,53.98 | U4.13 28.23,73.69 arc45 v29.69,74.3
  Bottom 0.305: v28.89,53.98 28.89,56.38 arc-45 29.21,57.15 arc45 29.53,57.92 29.53,59.24 arc-45 29.84,60.01 30.98,61.15 arc45 31.43,62.23 31.43,67.53 arc45 30.69,69.32 30.59,69.42 arc-45 29.84,71.22 29.84,74.14 v29.69,74.3

## Text on the board
tNames: Tx | Rx | Vin | GND | XIN | 3V3 | 15 | 14 | 11 | GND | osmo-clock-gen / (C) 2019 Harald Welte / Mfg: sysmocom GmbH / OSHW / CC-BY-SA | A | B | C | D | 3V3 | 3V3 | ADJ | ADJ
bNames: osmo-clock-gen / (C) 2019 by / Harald Welte / Mfg: sysmocom GmbH / OSHW / CC-BY-SA